# Altium schematic sheet DAC_Block.SchDoc
size A4; SheetNumber: 4; SheetTotal: 13
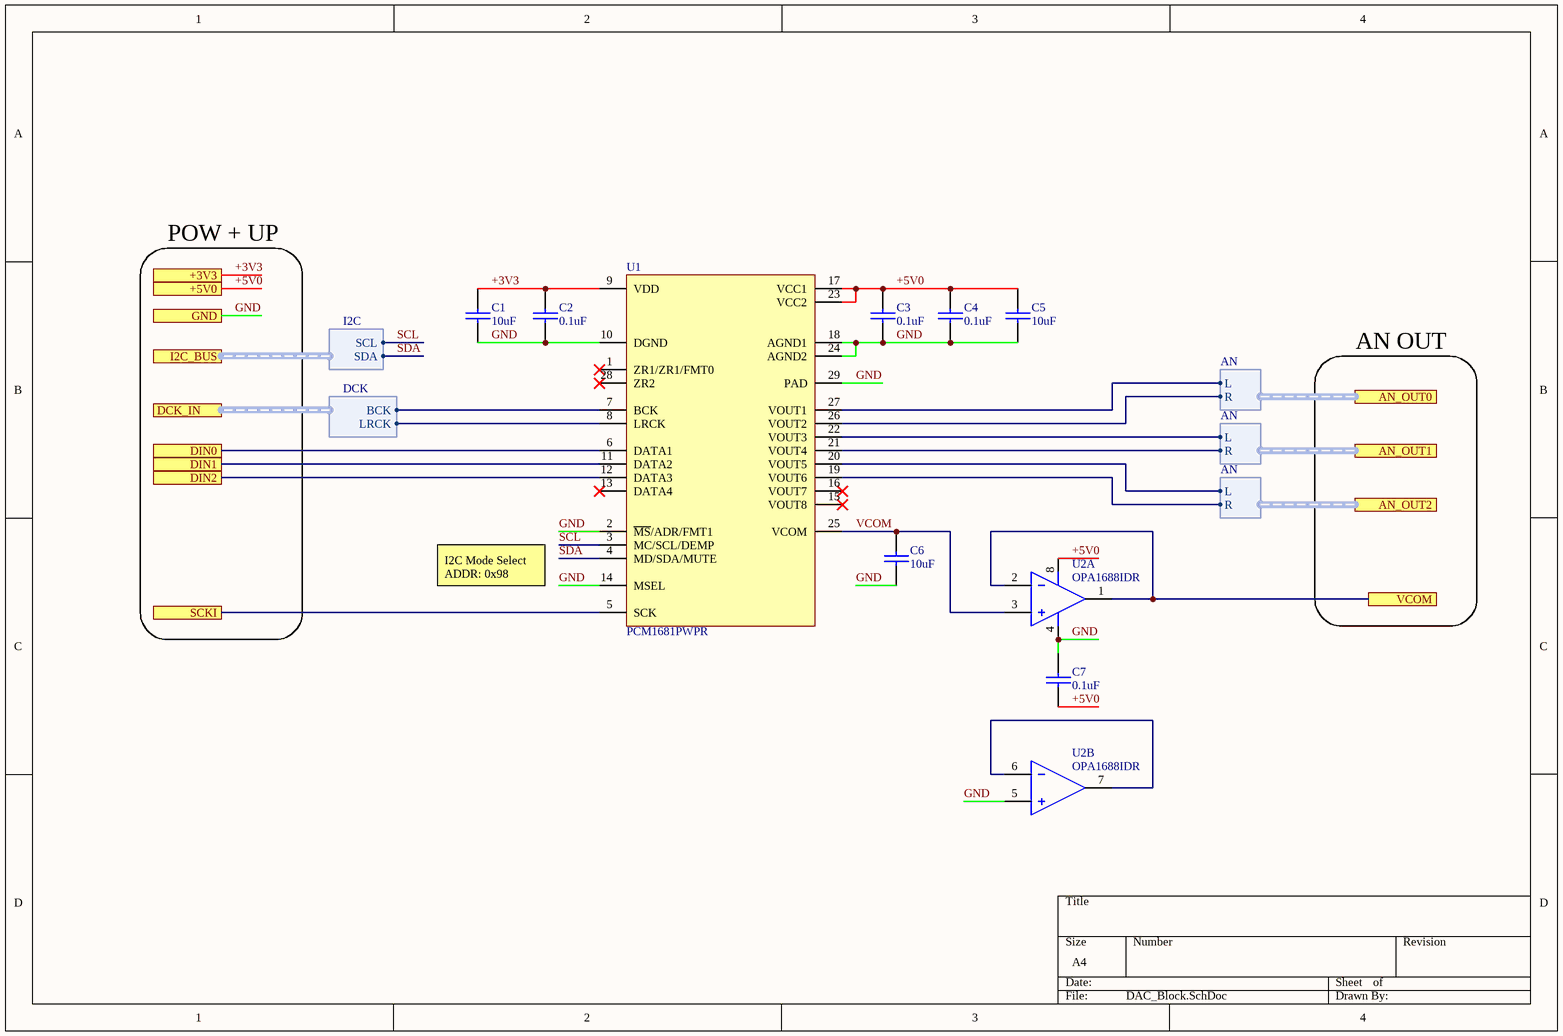
[diagram p0: DAC_Block.SchDoc]

## Parts
C1  10uF  [0603-CAP-TDK]
C2  0.1uF  [0402-CAP-TDK]
C3  0.1uF  [0402-CAP-TDK]
C4  0.1uF  [0402-CAP-TDK]
C5  10uF  [0603-CAP-TDK]
C6  10uF  [0603-CAP-TDK]
C7  0.1uF  [0402-CAP-TDK]
U1  PCM1681PWPR  [PCM1681PWPR]
U2  OPA1688IDR  [TI-SOIC-8]  (parts A,B of 2)

## Ports
+3V3 (see AudioDSP-v2.0_top[5C], ADC_Block[1A], ADC_Interface[1B], CTRL_Connectors[1A], DSP_Block[1A], MCU_Block[1A], PLL_Block[1A], POW_Block[4B]), +5V0 (see AudioDSP-v2.0_top[5C], LPF_Block[1B], LPF_Interface[1B], POW_Block[4B]), AN_OUT0 (harness AN, see AudioDSP-v2.0_top[6C]), AN_OUT1 (harness AN, see AudioDSP-v2.0_top[6C]), AN_OUT2 (harness AN, see AudioDSP-v2.0_top[6C]), DCK_IN (harness DCK, see AudioDSP-v2.0_top[5C]), DIN0 (see AudioDSP-v2.0_top[5C]), DIN1 (see AudioDSP-v2.0_top[5C]), DIN2 (see AudioDSP-v2.0_top[5C]), GND (see AudioDSP-v2.0_top[5C], ADC_Block[1B], ADC_Interface[1B], CTRL_Connectors[1A], DSP_Block[1B], IN_Connectors[3A], LPF_Block[1B], LPF_Interface[1B], MCU_Block[1B], OUT_Connectors[3B], PLL_Block[1A], POW_Block[1B]), I2C_BUS (harness I2C, see AudioDSP-v2.0_top[5C], ADC_Block[1B]), SCKI (see AudioDSP-v2.0_top[5C]), VCOM (see AudioDSP-v2.0_top[6C], LPF_Block[1C], LPF_Interface[1B])

## Harnesses
I2C: SCL, SDA
DCK: BCK, LRCK
AN: L, R

## Nets
+3V3: C1.2 C2.2 U1.9(VDD) ; port +3V3
+5V0: C3.2 C4.2 C5.2 C7.1 U1.17(VCC1) U1.23(VCC2) U2.8(VDD) ; port +5V0
DIN0: U1.6(DATA1) ; port DIN0
DIN1: U1.11(DATA2) ; port DIN1
DIN2: U1.12(DATA3) ; port DIN2
GND: C1.1 C2.1 C3.1 C4.1 C5.1 C6.1 C7.2 U1.2(~{MS}/ADR/FMT1) U1.10(DGND) U1.14(MSEL) U1.18(AGND1) U1.24(AGND2) U1.29(PAD) U2.4(GND) U2.5(2IN+) ; port GND
SCKI: U1.5(SCK) ; port SCKI
SCL: U1.3(MC/SCL/DEMP) ; port I2C_BUS.SCL
SDA: U1.4(MD/SDA/MUTE) ; port I2C_BUS.SDA
VCOM: C6.2 U1.25(VCOM) U2.3(1IN+)
VCOM: U2.1(1OUT) U2.2(1IN-) ; port VCOM  [a separate net that carries the same name]
NetU1_7: U1.7(BCK) ; port DCK_IN.BCK
NetU1_8: U1.8(LRCK) ; port DCK_IN.LRCK
NetU1_19: U1.19(VOUT6) ; port AN_OUT2.R
NetU1_20: U1.20(VOUT5) ; port AN_OUT2.L
NetU1_21: U1.21(VOUT4) ; port AN_OUT1.R
NetU1_22: U1.22(VOUT3) ; port AN_OUT1.L
NetU1_26: U1.26(VOUT2) ; port AN_OUT0.R
NetU1_27: U1.27(VOUT1) ; port AN_OUT0.L
NetU2_6: U2.6(2IN-) U2.7(2OUT)

Not connected (* = marked no-connect by the designer): U1 1(ZR1/ZR1/FMT0)* 13(DATA4)* 15(VOUT8)* 16(VOUT7)* 28(ZR2)*

## Notes on the sheet
- POW + UP
- AN OUT
- I2C Mode Select
  ADDR: 0x98

## Library data of the parts
C1-C7 = CAP-SMD
U2 = OPA1688IDR: Rail-To-Rail Amplifier 2 Circuit - 8-SOIC